# EAGLE design pulse_iot (EAGLE 7.3.0)
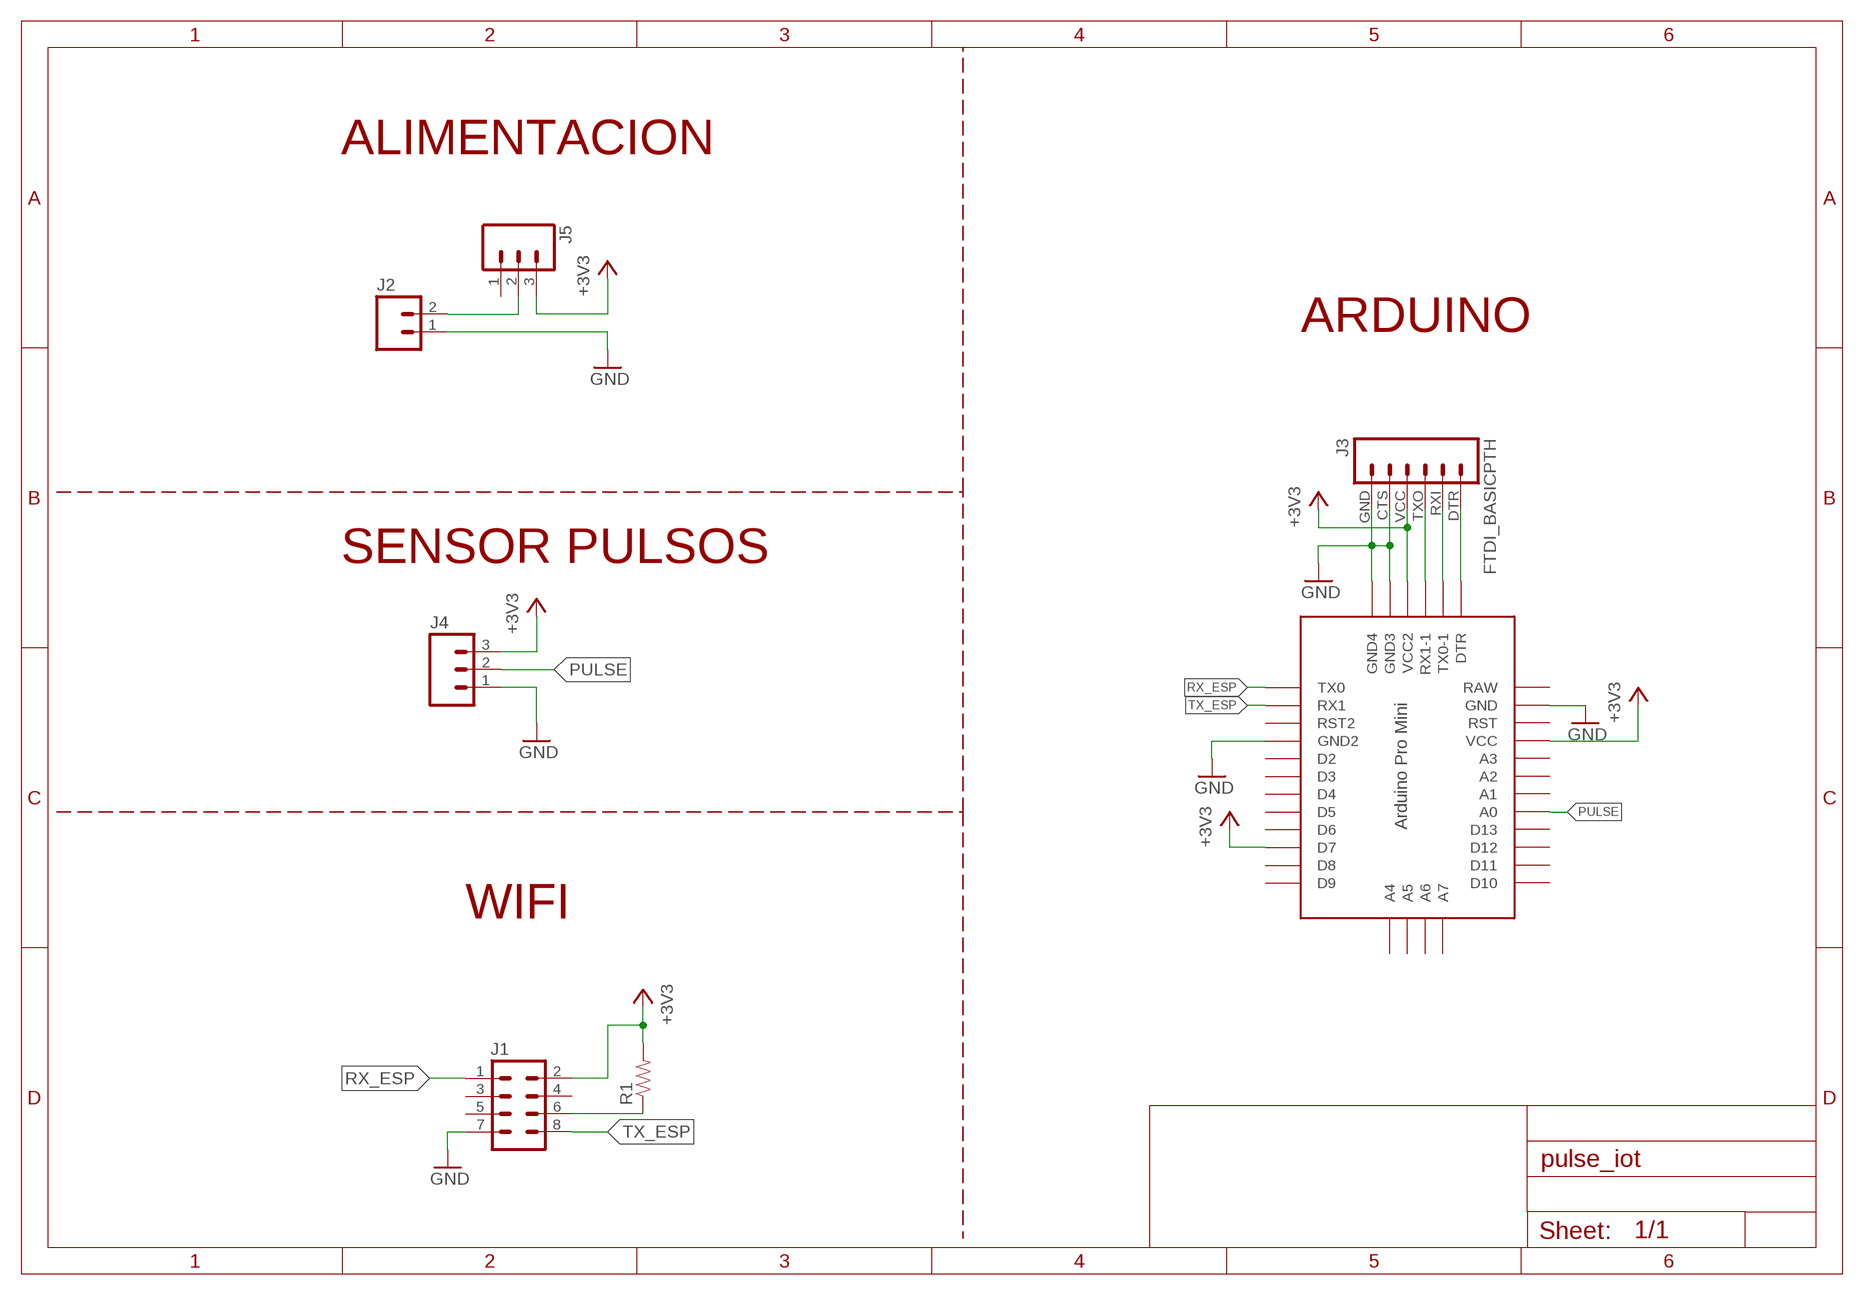
[diagram p0: schematic, sheet 1]

## Parts
J1  M04X2  [2X4]
J2  M025MM  [SCREWTERMINAL-5MM-2]
J3  FTDI_BASICPTH  [FTDI_BASIC]
J4  M03-SCREW-5MM  [SCREWTERMINAL-5MM-3]
J5  M03LONGPADS  [1X03_LONGPADS]
R1  RESISTORPTH1  [AXIAL-0.3]
U$1  PRO-MINI  [PRO-MINI]

## Nets
+3V3: J1.2 J3.VCC J4.3 J5.3 R1.P$2 U$1.D7 U$1.VCC U$1.VCC1(VCC2)
GND: J1.7 J2.1 J3.CTS J3.GND J4.1 U$1.GND U$1.GND1(GND2) U$1.GND2(GND4) U$1.GND3
N$4: J3.TXO U$1.RX1-1
N$5: J3.RXI U$1.TX0-1
N$6: J3.DTR U$1.DTR
N$7: J1.6 R1.P$1
N$8: J2.2 J5.2
PULSE: J4.2 U$1.A0
RX_ESP: J1.1 U$1.TX0
TX_ESP: J1.8 U$1.RX1
Unconnected: J1.3 J1.4 J1.5 J5.1 U$1.A1 U$1.A2 U$1.A3 U$1.A4 U$1.A5 U$1.A6 U$1.A7 U$1.D2 U$1.D3 U$1.D4 U$1.D5 U$1.D6 U$1.D8 U$1.D9 U$1.D10 U$1.D11 U$1.D12 U$1.D13 U$1.RST U$1.RST1(RST2)

## Notes on the sheet
- ALIMENTACION
- ARDUINO
- SENSOR PULSOS
- WIFI

## Power pins joined to a net without a drawn wire
RAW: U$1.RAW

## Library data of the parts
J1 = SparkFun-Connectors:M04X2: .1" header, two rows of four.
J2 = SparkFun-Connectors:M02: Standard 2-pin 0.1" header. Use with - straight break away headers ( PRT-00116) - right angle break away headers (PRT-00553) - swiss pins (PRT-00743) - machine pins (PRT-00117) - female headers (PRT-00115) Molex polarized connector foot print use with: PRT-08233 with associated crimp pins and housings. 2.54_SCREWTERM for use with PRT-10571. 3.5mm Screw Terminal footprints for PRT-08084 5mm Screw Terminal footprints for use with PRT-08432; STOREFRONT_ID: PRT-08432
J3 = SparkFun-Connectors:FTDI_BASIC: FTDI Basic header with labels
J4 = SparkFun-Connectors:M03: Header 3 Standard 3-pin 0.1" header. Use with straight break away headers (SKU : PRT-00116), right angle break away headers (PRT-00553), swiss pins (PRT-00743), machine pins (PRT-00117), and female headers (PRT-00115). Molex polarized connector foot print use with SKU : PRT-08232 with associated crimp pins and housings.; STOREFRONT_ID: PRT-08433
J5 = SparkFun-Connectors:M03: Header 3 Standard 3-pin 0.1" header. Use with straight break away headers (SKU : PRT-00116), right angle break away headers (PRT-00553), swiss pins (PRT-00743), machine pins (PRT-00117), and female headers (PRT-00115). Molex polarized connector foot print use with SKU : PRT-08232 with associated crimp pins and housings.
R1 = 5hz-electronica:RESISTOR: Resistor Basic schematic elements and footprints for 0603, 1206, and PTH 1/10th watt (small) resistors.
U$1 = Arduino-clone:PRO-MINI: Arduion Pro Mini Clone V1.0 www.betemcu.cu

## Board
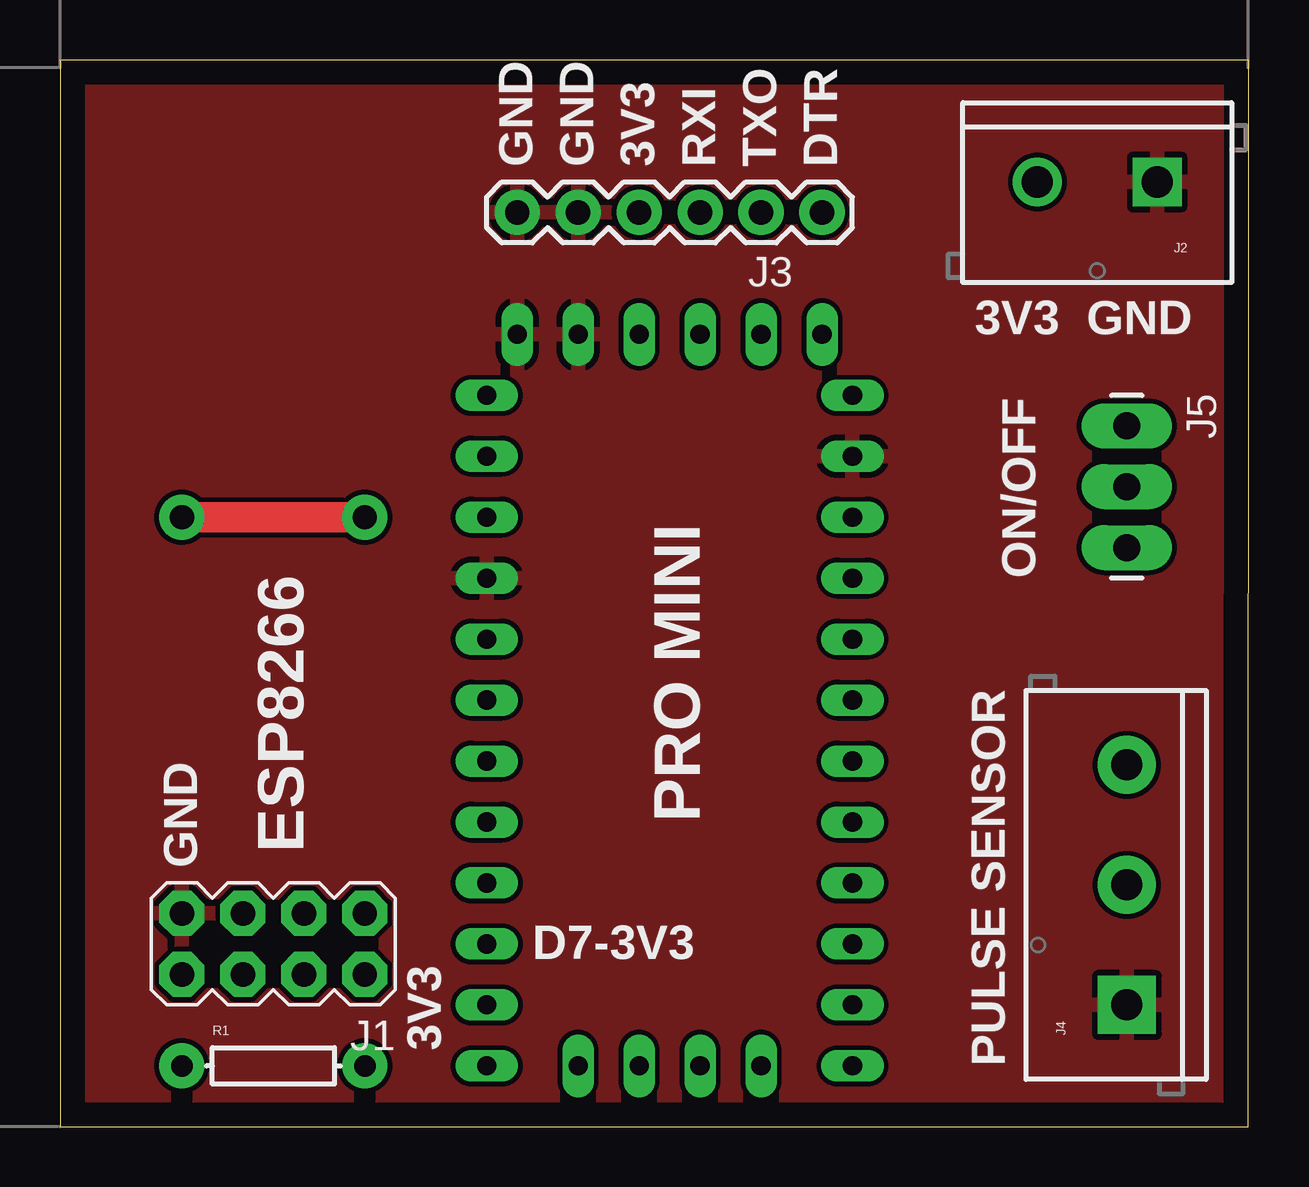
[diagram p1: board, top side]
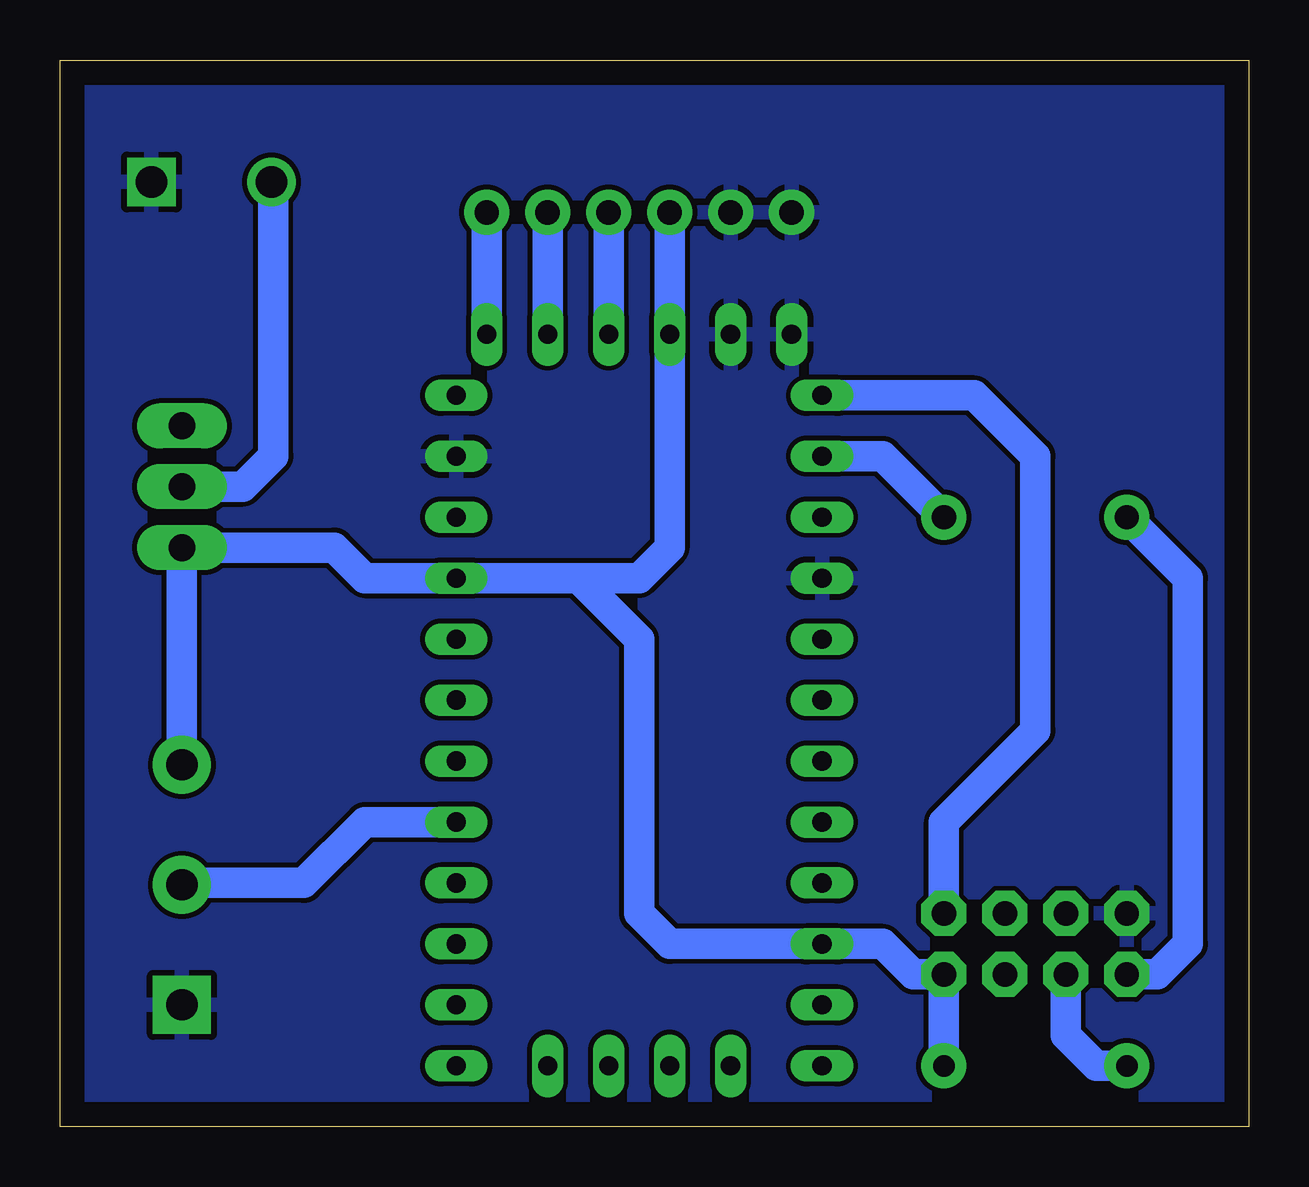
[diagram p2: board, bottom side, seen from below]

Size 49.53 x 44.45 mm. Coordinates in mm from the lower left corner, seen from the top.
Outline: 0,0 49.51,0 49.53,44.45 0,44.45 0,0
Copper layers (1*16): Top 0.035mm / dielectric 1.5mm / Bottom 0.035mm
Design rules "default": minimum track width 10mil, minimum drill 24mil, track to track 8mil, track to pad 8mil, pad to pad 8mil, via to via 8mil, smd to smd 8mil, copper to edge 40mil, drill to drill 8mil, minimum pad ring 10mil, minimum via ring 8mil, stop-mask expansion 4mil, vias tented up to drill 0mil, thermal gap 10mil

### Footprints (pad centres in the part's own frame; a part is rotated, then mirrored left to right if it is on the bottom)
2X4 = drill 1.016 pad 1.88 octagon: 1 -3.81,-1.27; 2 -3.81,1.27; 3 -1.27,-1.27; 4 -1.27,1.27; 5 1.27,-1.27; 6 1.27,1.27; 7 3.81,-1.27; 8 3.81,1.27
SCREWTERMINAL-5MM-2 = drill 1.3 pad 2.032 square: 1 0,0 | drill 1.3 pad 2.032: 2 5,0
FTDI_BASIC = drill 1.016 pad 1.88: CTS 10.16,0; DTR 0,0; GND 12.7,0; RXI 2.54,0; TXO 5.08,0; VCC 7.62,0
SCREWTERMINAL-5MM-3 = drill 1.3 pad 2.413 square: 1 0,0 | drill 1.3 pad 2.413: 2 5,0; 3 10,0
1X03_LONGPADS = drill 1.118 pad 1.88 long: 1 0,0; 2 2.54,0; 3 5.08,0
AXIAL-0.3 = drill 0.9 pad 1.88: P$1 -3.81,0; P$2 3.81,0
PRO-MINI = drill 0.8 long: A0 8.89,8.89; A1 8.89,11.43; A2 8.89,13.97; A3 8.89,16.51; A4 -2.54,-1.27; A5 0,-1.27; A6 2.54,-1.27; A7 5.08,-1.27; D2 -6.35,16.51; D3 -6.35,13.97; D4 -6.35,11.43; D5 -6.35,8.89; D6 -6.35,6.35; D7 -6.35,3.81; D8 -6.35,1.27; D9 -6.35,-1.27; D10 8.89,-1.27; D11 8.89,1.27; D12 8.89,3.81; D13 8.89,6.35; DTR 7.62,29.21; GND 8.89,24.13; GND1 -6.35,19.05; GND2 -5.08,29.21; GND3 -2.54,29.21; RAW 8.89,26.67; RST 8.89,21.59; RST1 -6.35,21.59; RX1 -6.35,24.13; RX1-1 2.54,29.21; TX0 -6.35,26.67; TX0-1 5.08,29.21; VCC 8.89,19.05; VCC1 0,29.21

### Placement (x,y rotation side)
J1  8.89,7.62 180 top
J2  45.72,39.37 180 top
J3  31.75,38.1 180 top
J4  44.45,5.08 90 top
J5  44.45,29.21 270 top
R1  8.89,2.54 0 top
U$1  24.13,3.81 0 top

### Tracks (layer width: path | path; a pad name or v marks a point on that pad's centre or on a via)
+3V3
  Bottom 1.27: R1.P$2 J1.2 13.97,6.35 15.24,7.62 U$1.D7 24.13,7.62 25.4,8.89 25.4,20.32 27.94,22.86 | 27.94,22.86 U$1.VCC 36.83,22.86 38.1,24.13 J5.3 J4.3 | J3.VCC U$1.VCC1 24.13,24.13 25.4,22.86 27.94,22.86
GND
  pour Bottom: 0,0 0,44.45 49.53,44.45 49.53,0
  pour Top: 0,0 0,44.45 49.53,44.45 49.53,0
N$4
  Bottom 1.27: U$1.RX1-1 J3.TXO
N$5
  Bottom 1.27: U$1.TX0-1 J3.RXI
N$6
  Bottom 1.27: U$1.DTR J3.DTR
N$7
  Bottom 1.27: R1.P$1 6.35,2.54 7.62,3.81 J1.6
N$8
  Bottom 1.27: J5.2 41.91,26.67 40.64,27.94 40.64,39.29 J2.2
PULSE
  Bottom 1.27: U$1.A0 36.83,12.7 39.37,10.16 44.37,10.16 J4.2
RX_ESP
  Bottom 1.27: J1.1 12.7,12.7 8.89,16.51 8.89,27.94 11.43,30.48 U$1.TX0
TX_ESP  (via drill 1.02 pad 1.88)
  Top 1.27: v5.08,25.4 v12.7,25.4
  Bottom 1.27: J1.8 3.81,6.35 2.54,7.62 2.54,22.86 v5.08,25.4 | v12.7,25.4 15.24,27.94 U$1.RX1

### Text on the board
tPlace: GND | GND | 3V3 | RXI | TXO | DTR | 3V3 GND | ON/OFF | PRO MINI | GND | ESP8266 | D7-3V3 | 3V3 | PULSE SENSOR